# Altium project Room03.PrjPCB
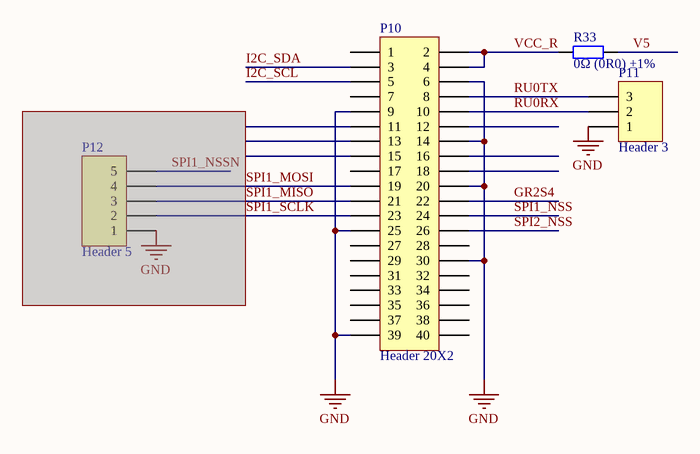
[diagram p0: raspi.SchDoc]
5 sheets, 92 parts. Net scope: global (net labels, ports and power ports of the same name join across sheets).
Board file: Room03.PcbDoc
Sheets:
  raspi.SchDoc
  power.SchDoc
  commu.SchDoc
  mcu.SchDoc
  other.SchDoc

## Sheet raspi.SchDoc
size A4

### Parts
P10  Header 20X2  [HDR2X20]
P11  Header 3  [HDR1X3]
P12  Header 5  [HDR1X5]  (masked out: inside a compile mask, not in the netlist)
R33  0Ω (0R0) ±1%  [1206_R]

### Nets
GND: P10.6 P10.9 P10.14 P10.20 P10.25 P10.30 P10.39 P11.1
V5: R33.2
GR2S4: P10.22
I2C_SCL: P10.5
I2C_SDA: P10.3
RU0RX: P10.10 P11.2
RU0TX: P10.8 P11.3
SPI1_NSS: P10.24
SPI2_NSS: P10.26
VCC_R: P10.2 P10.4 R33.1

Not connected (* = marked no-connect by the designer): P10 1 7 11 12 13 15 16 17 18 19 21 23 27 28 29 31 32 33 34 35 36 37 38 40

### Library data of the parts
P10 = Header 20X2: Header, 20-Pin, Dual row; LatestRevisionDate: 17-Jul-2002; LatestRevisionNote: Re-released for DXP Platform.; Publisher: Altium Limited
P11 = Header 3: Header, 3-Pin; LatestRevisionDate: 17-Jul-2002; LatestRevisionNote: Re-released for DXP Platform.; Publisher: Altium Limited
P12 = Header 5: Header, 5-Pin; LatestRevisionDate: 17-Jul-2002; LatestRevisionNote: Re-released for DXP Platform.; Publisher: Altium Limited
R33 = 1206 0Ω (0R0) 1%: 贴片电阻; ComponentLink1Description: 供应商链接; ComponentLink1URL: http://www.szlcsc.com/product/details_18576.html; Package: 1206; Supplier: LC; SuppliersPartNumber: C17888

## Sheet power.SchDoc
size A4
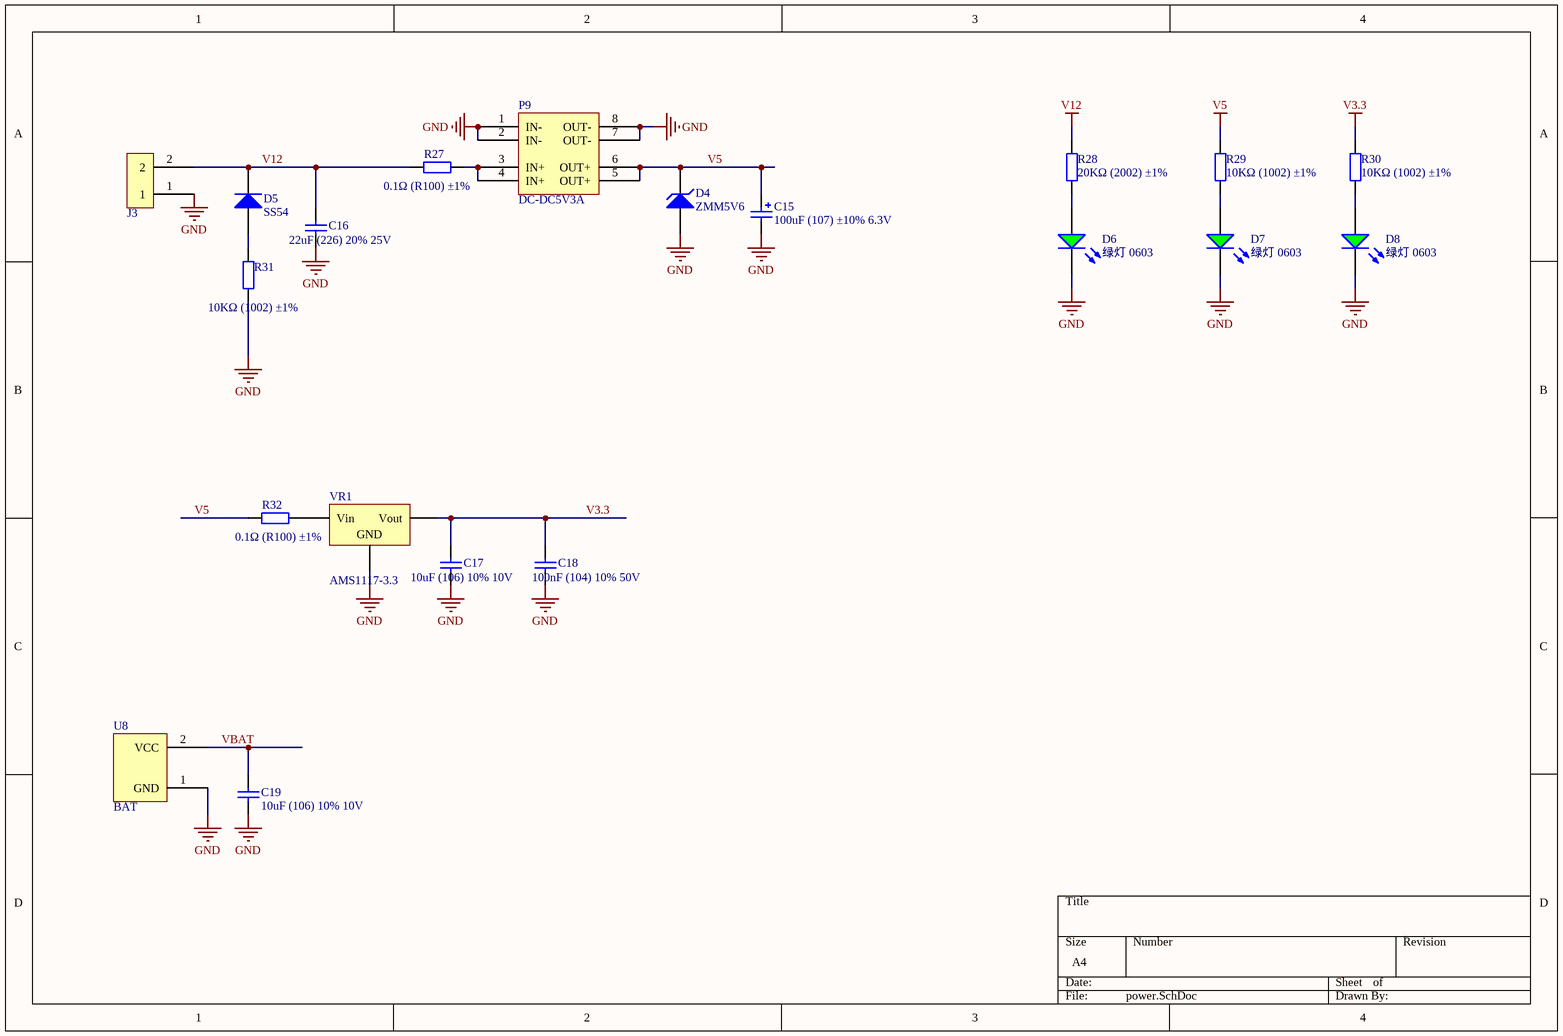
[diagram p1: power.SchDoc]

### Parts
C15  100uF (107) ±10% 6.3V  [CASE-B_3528]
C16  22uF (226) 20% 25V  [0805_C]
C17  10uF (106) 10% 10V  [0603_C]
C18  100nF (104) 10% 50V  [0603_C]
C19  10uF (106) 10% 10V  [0603_C]
D4  ZMM5V6  [LL-34]
D5  SS54  [SMA(DO-214AC)_S1]
D6  绿灯 0603  [0603_LED_S1]
D7  绿灯 0603  [0603_LED_S1]
D8  绿灯 0603  [0603_LED_S1]
J3  XK7.62-2P  [XK7.62-2P]  (value not drawn)
P9  DC-DC5V3A  [DC-DC3A]
R27  0.1Ω (R100) ±1%  [1206_R]
R28  20KΩ (2002) ±1%  [0603_R]
R29  10KΩ (1002) ±1%  [0603_R]
R30  10KΩ (1002) ±1%  [0603_R]
R31  10KΩ (1002) ±1%  [0805_R]
R32  0.1Ω (R100) ±1%  [1206_R]
U8  BAT  [BAT2032]
VR1  AMS1117-3.3  [SOT-223]

### Nets
GND: C15.2 C16.1 C17.1 C18.1 C19.1 D4.1(A) D6.K D7.K D8.K J3.1 P9.1(IN-) P9.2(IN-) P9.7(OUT-) P9.8(OUT-) R31.1 U8.1(GND) VR1.1(GND)
V3.3: C17.2 C18.2 R30.2 VR1.2(Vout)
V5: C15.1 D4.2(K) P9.5(OUT+) P9.6(OUT+) R29.2 R32.1
V12: C16.2 D5.2(K) J3.2 R27.1 R28.2
VBAT: C19.2 U8.2(VCC)
NetD5_1: D5.1(A) R31.2
NetD6_A: D6.A R28.1
NetD7_A: D7.A R29.1
NetD8_A: D8.A R30.1
NetP9_3: P9.3(IN+) P9.4(IN+) R27.2
NetR32_2: R32.2 VR1.3(Vin)

### Library data of the parts
C15 = 3528 100uF (107) 10% 6.3V: 钽电容; ComponentLink1Description: 供应商链接; ComponentLink1URL: http://www.szlcsc.com/product/details_16815.html; Package: 3528; Supplier: LC; SuppliersPartNumber: C16133
C16 = 0805 22uF (226) 20% 25V: 贴片电容; ComponentLink1Description: 供应商链接; ComponentLink1URL: http://www.szlcsc.com/product/details_46786.html; Package: 0805; Supplier: LC; SuppliersPartNumber: C45783
C17 C19 = 0603 10uF (106) 10% 10V: 贴片电容; ComponentLink1Description: 供应商链接; ComponentLink1URL: http://www.szlcsc.com/product/details_20411.html; Package: 0603; Supplier: LC; SuppliersPartNumber: C19702
C18 = 0603 100nF (104) 10% 50V: 贴片电容; ComponentLink1Description: 供应商链接; ComponentLink1URL: http://www.szlcsc.com/product/details_15331.html; Package: 0603; Supplier: LC; SuppliersPartNumber: C14663
D4 = LL-34 ZMM5V6: 稳压二极管; ComponentLink1Description: 供应商链接; ComponentLink1URL: http://www.szlcsc.com/product/details_8541.html; Package: LL-34; Supplier: LC; SuppliersPartNumber: C8062
D5 = SMA(DO-214AC) SS54: 二极管; ComponentLink1Description: 供应商链接; ComponentLink1URL: http://www.szlcsc.com/product/details_23178.html; Package: SMA(DO-214AC); Supplier: LC; SuppliersPartNumber: C22452
D6-D8 = 0603 绿灯: 发光二极管; ComponentLink1Description: 供应商链接; ComponentLink1URL: http://www.szlcsc.com/product/details_73152.html; Package: 0603; Supplier: LC; SuppliersPartNumber: C72043
P9 = DC-DC3A
R27 R32 = 1206 0.1Ω (R100) 1%: 贴片电阻; ComponentLink1Description: 供应商链接; ComponentLink1URL: http://www.szlcsc.com/product/details_26077.html; Package: 1206; Supplier: LC; SuppliersPartNumber: C25334
R28 = 0603 20KΩ (2002) 1%: 贴片电阻; ComponentLink1Description: 供应商链接; ComponentLink1URL: http://www.szlcsc.com/product/details_4591.html; Package: 0603; Supplier: LC; SuppliersPartNumber: C4184
R29 R30 = 0603 10KΩ (1002) 1%: 贴片电阻; ComponentLink1Description: 供应商链接; ComponentLink1URL: http://www.szlcsc.com/product/details_26547.html; Package: 0603; Supplier: LC; SuppliersPartNumber: C25804
R31 = 0805 10KΩ (1002) 1%: 贴片电阻; ComponentLink1Description: 供应商链接; ComponentLink1URL: http://www.szlcsc.com/product/details_18102.html; Package: 0805; Supplier: LC; SuppliersPartNumber: C17414
U8 = BAT2032
VR1 = SOT-223 AMS1117-3.3: 低压差线性稳压(LDO); ComponentLink1Description: 供应商链接; ComponentLink1URL: http://www.szlcsc.com/product/details_6652.html; Package: SOT-223; Supplier: LC; SuppliersPartNumber: C6186

## Sheet commu.SchDoc
size A4
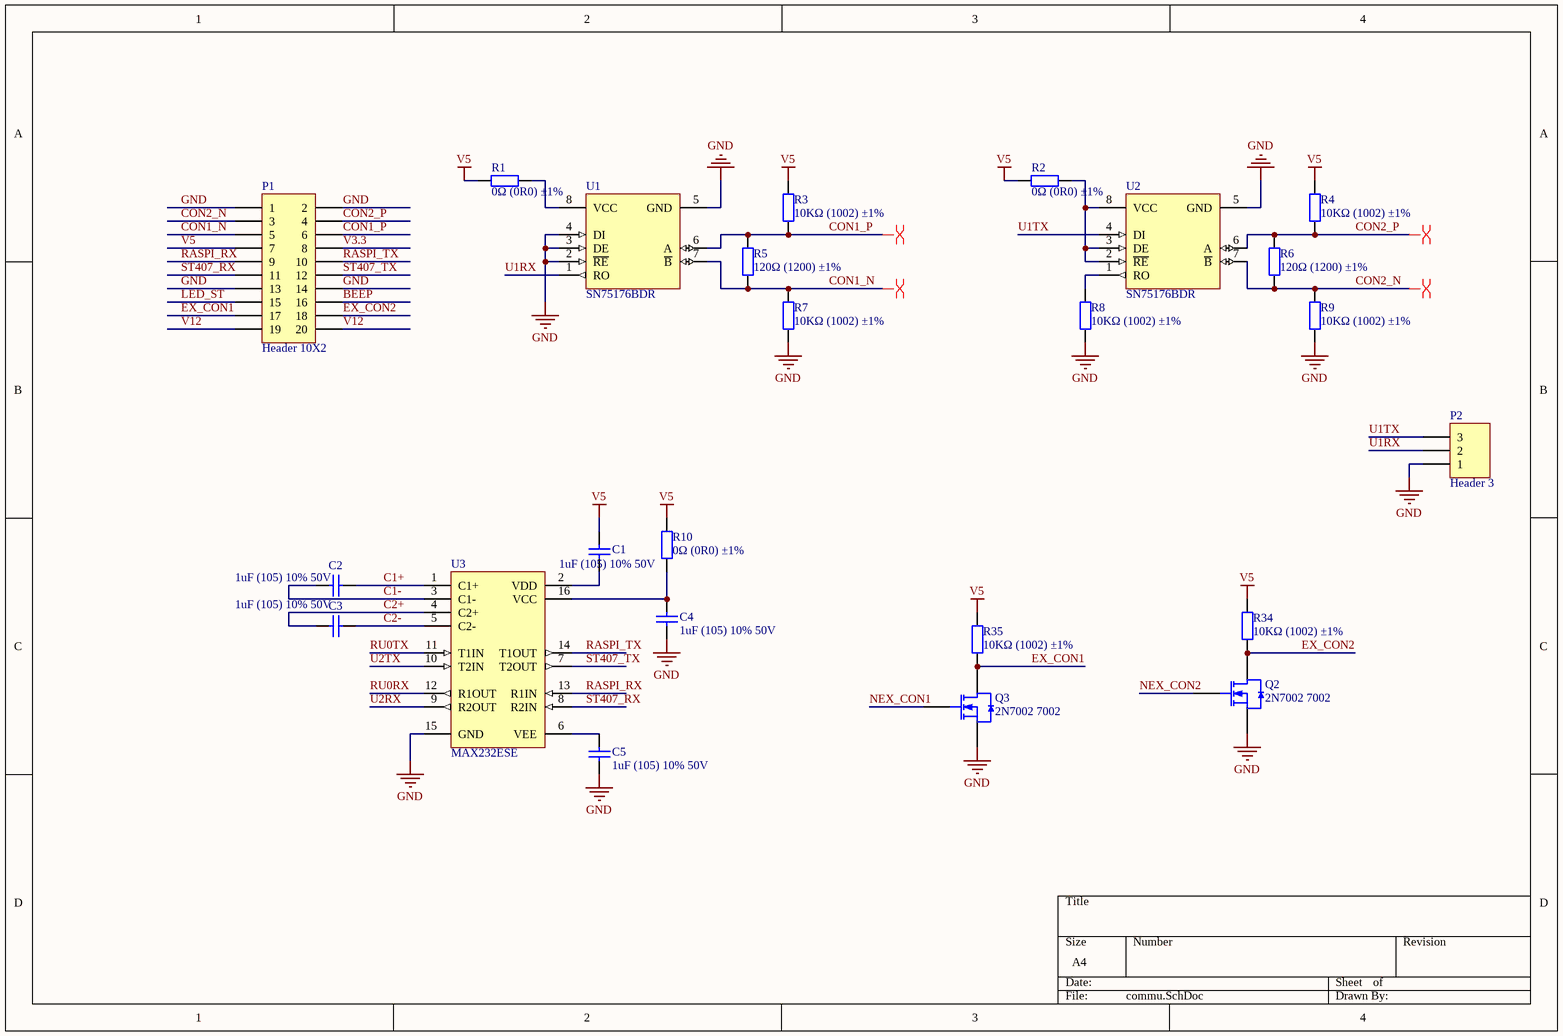
[diagram p2: commu.SchDoc]

### Parts
C1  1uF (105) 10% 50V  [0603_C]
C2  1uF (105) 10% 50V  [0603_C]
C3  1uF (105) 10% 50V  [0603_C]
C4  1uF (105) 10% 50V  [0603_C]
C5  1uF (105) 10% 50V  [0603_C]
P1  Header 10X2  [HDR2X10]
P2  Header 3  [HDR1X3]
Q2  2N7002 7002  [SOT-23(SOT-23-3)]
Q3  2N7002 7002  [SOT-23(SOT-23-3)]
R1  0Ω (0R0) ±1%  [1206_R]
R2  0Ω (0R0) ±1%  [1206_R]
R3  10KΩ (1002) ±1%  [0603_R]
R4  10KΩ (1002) ±1%  [0603_R]
R5  120Ω (1200) ±1%  [0603_R]
R6  120Ω (1200) ±1%  [0603_R]
R7  10KΩ (1002) ±1%  [0603_R]
R8  10KΩ (1002) ±1%  [0603_R]
R9  10KΩ (1002) ±1%  [0603_R]
R10  0Ω (0R0) ±1%  [1206_R]
R34  10KΩ (1002) ±1%  [0603_R]
R35  10KΩ (1002) ±1%  [0603_R]
U1  SN75176BDR  [SOIC-8_150mil]
U2  SN75176BDR  [SOIC-8_150mil]
U3  MAX232ESE  [SOIC-16_150mil]

### Nets
GND: C4.1 C5.1 P1.1 P1.2 P1.13 P1.14 P2.1 Q2.2(S) Q3.2(S) R7.1 R8.1 R9.1 U1.2(~{RE}) U1.3(DE) U1.4(DI) U1.5(GND) U2.5(GND) U3.15(GND)
V3.3: P1.8
V5: C1.2 P1.7 R1.1 R2.1 R3.2 R4.2 R10.2 R34.2 R35.2
V12: P1.19 P1.20
BEEP: P1.16
C1+: C2.2 U3.1(C1+)
C1-: C2.1 U3.3(C1-)
C2+: C3.1 U3.4(C2+)
C2-: C3.2 U3.5(C2-)
CON1_N: P1.5 R5.1 R7.2 U1.7(~{B})
CON1_P: P1.6 R3.1 R5.2 U1.6(A)
CON2_N: P1.3 R6.1 R9.2 U2.7(~{B})
CON2_P: P1.4 R4.1 R6.2 U2.6(A)
EX_CON1: P1.17 Q3.3(D) R35.1
EX_CON2: P1.18 Q2.3(D) R34.1
LED_ST: P1.15
NEX_CON1: Q3.1(G)
NEX_CON2: Q2.1(G)
RASPI_RX: P1.9 U3.13(R1IN)
RASPI_TX: P1.10 U3.14(T1OUT)
RU0RX: U3.12(R1OUT)
RU0TX: U3.11(T1IN)
ST407_RX: P1.11 U3.8(R2IN)
ST407_TX: P1.12 U3.7(T2OUT)
U1RX: P2.2 U1.1(RO)
U1TX: P2.3 U2.4(DI)
U2RX: U3.9(R2OUT)
U2TX: U3.10(T2IN)
NetC1_1: C1.1 U3.2(VDD)
NetC4_2: C4.2 R10.1 U3.16(VCC)
NetC5_2: C5.2 U3.6(VEE)
NetR1_2: R1.2 U1.8(VCC)
NetR2_2: R2.2 U2.2(~{RE}) U2.3(DE) U2.8(VCC)
NetR8_2: R8.2 U2.1(RO)

### Layout directives
differential pair: CON1_N, CON1_P, CON2_N, CON2_P

### Library data of the parts
C1-C5 = 0603 1uF (105) 10% 50V: 贴片电容; ComponentLink1Description: 供应商链接; ComponentLink1URL: http://www.szlcsc.com/product/details_16531.html; Package: 0603; Supplier: LC; SuppliersPartNumber: C15849
P1 = Header 10X2: Header, 10-Pin, Dual row; LatestRevisionDate: 17-Jul-2002; LatestRevisionNote: Re-released for DXP Platform.; Publisher: Altium Limited
P2 = Header 3: Header, 3-Pin; LatestRevisionDate: 17-Jul-2002; LatestRevisionNote: Re-released for DXP Platform.; Publisher: Altium Limited
Q2 Q3 = 2N7002 7002: MOS(场效应管); ComponentLink1Description: 供应商链接; ComponentLink1URL: http://www.szlcsc.com/product/details_9040.html; Package: SOT-23(SOT-23-3); Supplier: LC; SuppliersPartNumber: C8545
R1 R2 R10 = 1206 0Ω (0R0) 1%: 贴片电阻; ComponentLink1Description: 供应商链接; ComponentLink1URL: http://www.szlcsc.com/product/details_18576.html; Package: 1206; Supplier: LC; SuppliersPartNumber: C17888
R3 R4 R7-R9 R34 R35 = 0603 10KΩ (1002) 1%: 贴片电阻; ComponentLink1Description: 供应商链接; ComponentLink1URL: http://www.szlcsc.com/product/details_26547.html; Package: 0603; Supplier: LC; SuppliersPartNumber: C25804
R5 R6 = 0603 120Ω (1200) 1%: 贴片电阻; ComponentLink1Description: 供应商链接; ComponentLink1URL: http://www.szlcsc.com/product/details_23514.html; Package: 0603; Supplier: LC; SuppliersPartNumber: C22787
U1 U2 = SN75176BDR_[C7063]: RS-485/RS-422; ComponentLink1Description: 供应商链接; ComponentLink1URL: http://www.szlcsc.com/product/details_7535.html; Package: SOIC-8_150mil; Supplier: LC; SuppliersPartNumber: C7063
U3 = MAX232ESE_[C26860]: RS232; ComponentLink1Description: 供应商链接; ComponentLink1URL: http://www.szlcsc.com/product/details_27608.html; Package: SOIC-16_150mil; Supplier: LC; SuppliersPartNumber: C26860

## Sheet mcu.SchDoc
size A4
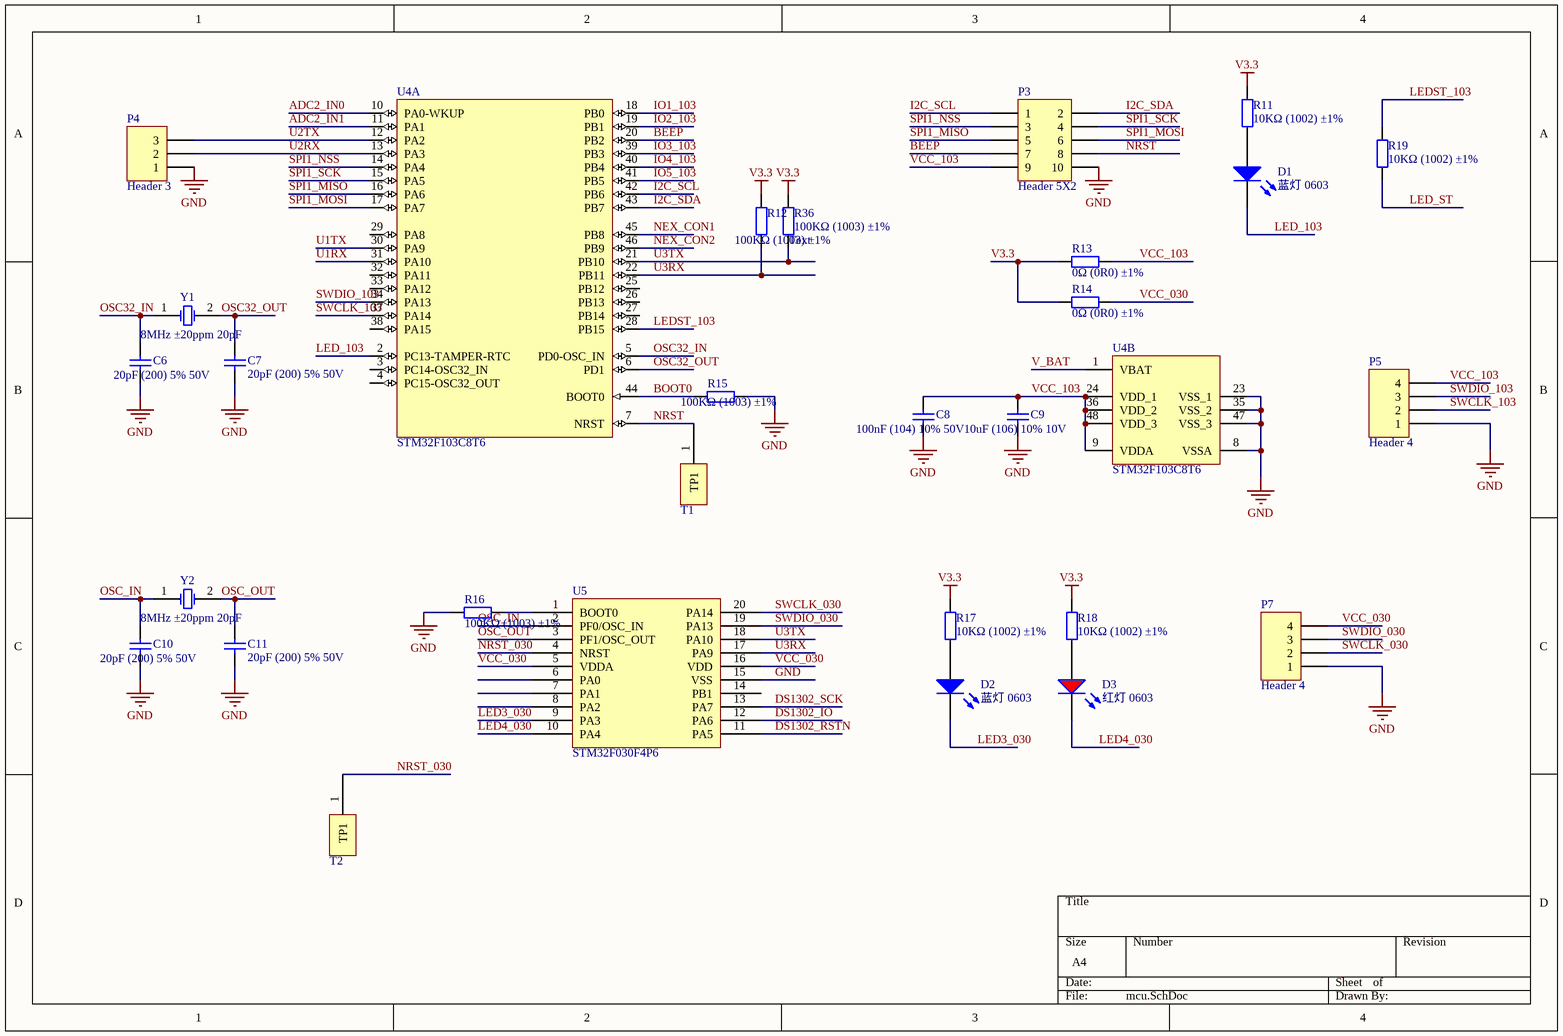
[diagram p3: mcu.SchDoc]

### Parts
C6  20pF (200) 5% 50V  [0603_C]
C7  20pF (200) 5% 50V  [0603_C]
C8  100nF (104) 10% 50V  [0603_C]
C9  10uF (106) 10% 10V  [0603_C]
C10  20pF (200) 5% 50V  [0603_C]
C11  20pF (200) 5% 50V  [0603_C]
D1  蓝灯 0603  [0603_LED_S1]
D2  蓝灯 0603  [0603_LED_S1]
D3  红灯 0603  [0603_LED_S1]
P3  Header 5X2  [HDR2X5]
P4  Header 3  [HDR1X3]
P5  Header 4  [HDR1X4]
P7  Header 4  [HDR1X4]
R11  10KΩ (1002) ±1%  [0603_R]
R12  100KΩ (1003) ±1%  [0603_R]
R13  0Ω (0R0) ±1%  [1206_R]
R14  0Ω (0R0) ±1%  [1206_R]
R15  100KΩ (1003) ±1%  [0603_R]
R16  100KΩ (1003) ±1%  [0603_R]
R17  10KΩ (1002) ±1%  [0603_R]
R18  10KΩ (1002) ±1%  [0603_R]
R19  10KΩ (1002) ±1%  [0603_R]
R36  100KΩ (1003) ±1%  [0603_R]
T1  TP1  [TP1]  (value not drawn)
T2  TP1  [TP1]  (value not drawn)
U4  STM32F103C8T6  [LQFP-48_7x7x05P]  (parts A,B of 2)
U5  STM32F030F4P6  [TSSOP-20]
Y1  8MHz ±20ppm 20pF  [SMD-5032_2P]
Y2  8MHz ±20ppm 20pF  [SMD-5032_2P]

### Nets
GND: C6.1 C7.1 C8.1 C9.2 C10.1 C11.1 P3.10 P4.1 P5.1 P7.1 R15.2 R16.1 U4.8(VSSA) U4.23(VSS_1) U4.35(VSS_2) U4.47(VSS_3) U5.15(VSS)
V3.3: R11.2 R12.2 R13.1 R14.1 R17.2 R18.2 R36.2
ADC2_IN0: U4.10(PA0-WKUP)
ADC2_IN1: U4.11(PA1)
BEEP: P3.7 U4.20(PB2)
BOOT0: R15.1 U4.44(BOOT0)
DS1302_IO: U5.12(PA6)
DS1302_RSTN: U5.11(PA5)
DS1302_SCK: U5.13(PA7)
I2C_SCL: P3.1 U4.42(PB6)
I2C_SDA: P3.2 U4.43(PB7)
IO1_103: U4.18(PB0)
IO2_103: U4.19(PB1)
IO3_103: U4.39(PB3)
IO4_103: U4.40(PB4)
IO5_103: U4.41(PB5)
LED3_030: D2.K U5.9(PA3)
LED4_030: D3.K U5.10(PA4)
LED_103: D1.K U4.2(PC13-TAMPER-RTC)
LED_ST: R19.1
LEDST_103: R19.2 U4.28(PB15)
NEX_CON1: U4.45(PB8)
NEX_CON2: U4.46(PB9)
NRST: P3.8 T1.1(TP1) U4.7(NRST)
NRST_030: T2.1(TP1) U5.4(NRST)
OSC32_IN: C6.2 U4.5(PD0-OSC_IN) Y1.1(OSC1)
OSC32_OUT: C7.2 U4.6(PD1) Y1.2(OSC2)
OSC_IN: C10.2 U5.2(PF0/OSC_IN) Y2.1(OSC1)
OSC_OUT: C11.2 U5.3(PF1/OSC_OUT) Y2.2(OSC2)
SPI1_MISO: P3.5 U4.16(PA6)
SPI1_MOSI: P3.6 U4.17(PA7)
SPI1_NSS: P3.3 U4.14(PA4)
SPI1_SCK: P3.4 U4.15(PA5)
SWCLK_030: P7.2 U5.20(PA14)
SWCLK_103: P5.2 U4.37(PA14)
SWDIO_030: P7.3 U5.19(PA13)
SWDIO_103: P5.3 U4.34(PA13)
U1RX: U4.31(PA10)
U1TX: U4.30(PA9)
U2RX: P4.2 U4.13(PA3)
U2TX: P4.3 U4.12(PA2)
U3RX: R12.1 U4.22(PB11) U5.17(PA9)
U3TX: R36.1 U4.21(PB10) U5.18(PA10)
V_BAT: U4.1(VBAT)
VCC_030: P7.4 R14.2 U5.5(VDDA) U5.16(VDD)
VCC_103: C8.2 C9.1 P3.9 P5.4 R13.2 U4.9(VDDA) U4.24(VDD_1) U4.36(VDD_2) U4.48(VDD_3)
NetD1_A: D1.A R11.1
NetD2_A: D2.A R17.1
NetD3_A: D3.A R18.1
NetR16_2: R16.2 U5.1(BOOT0)

Not connected (* = marked no-connect by the designer): U4 3(PC14-OSC32_IN) 4(PC15-OSC32_OUT) 25(PB12) 26(PB13) 27(PB14) 29(PA8) 32(PA11) 33(PA12) 38(PA15); U5 6(PA0) 7(PA1) 8(PA2) 14(PB1)

### Notes on the sheet
- (near R36) Text

### Library data of the parts
C6 C7 C10 C11 = 0603 20pF (200) 5% 50V: 贴片电容; ComponentLink1Description: 供应商链接; ComponentLink1URL: http://www.szlcsc.com/product/details_2000.html; Package: 0603; Supplier: LC; SuppliersPartNumber: C1648
C8 = 0603 100nF (104) 10% 50V: 贴片电容; ComponentLink1Description: 供应商链接; ComponentLink1URL: http://www.szlcsc.com/product/details_15331.html; Package: 0603; Supplier: LC; SuppliersPartNumber: C14663
C9 = 0603 10uF (106) 10% 10V: 贴片电容; ComponentLink1Description: 供应商链接; ComponentLink1URL: http://www.szlcsc.com/product/details_20411.html; Package: 0603; Supplier: LC; SuppliersPartNumber: C19702
D1 D2 = 0603 蓝灯: 发光二极管; ComponentLink1Description: 供应商链接; ComponentLink1URL: http://www.szlcsc.com/product/details_73150.html; Package: 0603; Supplier: LC; SuppliersPartNumber: C72041
D3 = 0603 红灯: 发光二极管; ComponentLink1Description: 供应商链接; ComponentLink1URL: http://www.szlcsc.com/product/details_2659.html; Package: 0603; Supplier: LC; SuppliersPartNumber: C2286
P3 = Header 5X2: Header, 5-Pin, Dual row; LatestRevisionDate: 17-Jul-2002; LatestRevisionNote: Re-released for DXP Platform.; Publisher: Altium Limited
P4 = Header 3: Header, 3-Pin; LatestRevisionDate: 17-Jul-2002; LatestRevisionNote: Re-released for DXP Platform.; Publisher: Altium Limited
P5 P7 = Header 4: Header, 4-Pin; LatestRevisionDate: 17-Jul-2002; LatestRevisionNote: Re-released for DXP Platform.; Publisher: Altium Limited
R11 R17-R19 = 0603 10KΩ (1002) 1%: 贴片电阻; ComponentLink1Description: 供应商链接; ComponentLink1URL: http://www.szlcsc.com/product/details_26547.html; Package: 0603; Supplier: LC; SuppliersPartNumber: C25804
R12 R15 R16 R36 = 0603 100KΩ (1003) 1%: 贴片电阻; ComponentLink1Description: 供应商链接; ComponentLink1URL: http://www.szlcsc.com/product/details_26546.html; Package: 0603; Supplier: LC; SuppliersPartNumber: C25803
R13 R14 = 1206 0Ω (0R0) 1%: 贴片电阻; ComponentLink1Description: 供应商链接; ComponentLink1URL: http://www.szlcsc.com/product/details_18576.html; Package: 1206; Supplier: LC; SuppliersPartNumber: C17888
U4 = STM32F103C8T6: ARM; ComponentLink1Description: 供应商链接; ComponentLink1URL: http://www.szlcsc.com/product/details_9243.html; Package: LQFP-48_7x7x05P; Supplier: LC; SuppliersPartNumber: C8734
U5 = STM32F030F4P6: ARM; ComponentLink1Description: 供应商链接; ComponentLink1URL: http://www.szlcsc.com/product/details_33873.html; Package: TSSOP-20; Supplier: LC; SuppliersPartNumber: C32908
Y1 Y2 = SMD-5032_2P 8MHz 20ppm 20pF: 贴片晶振; ComponentLink1Description: 供应商链接; ComponentLink1URL: http://www.szlcsc.com/product/details_117214.html; Package: SMD-5032_2P; Supplier: LC; SuppliersPartNumber: C115962

## Sheet other.SchDoc
size A4
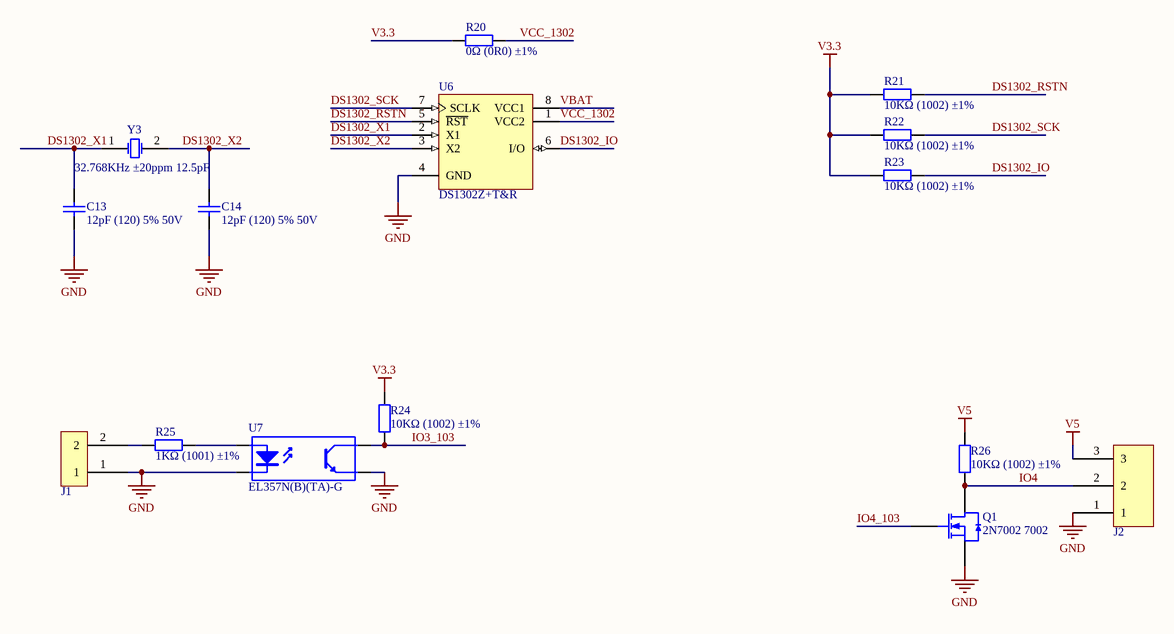
[diagram p4: other.SchDoc]

### Parts
C13  12pF (120) 5% 50V  [0603_C]
C14  12pF (120) 5% 50V  [0603_C]
J1  KF301-2P  [KF301-2P]  (value not drawn)
J2  KF301-3P  [KF301-3P]  (value not drawn)
Q1  2N7002 7002  [SOT-23(SOT-23-3)]
R20  0Ω (0R0) ±1%  [1206_R]
R21  10KΩ (1002) ±1%  [0603_R]
R22  10KΩ (1002) ±1%  [0603_R]
R23  10KΩ (1002) ±1%  [0603_R]
R24  10KΩ (1002) ±1%  [1206_R]
R25  1KΩ (1001) ±1%  [1206_R]
R26  10KΩ (1002) ±1%  [1206_R]
U6  DS1302Z+T&R  [SOIC-8_150mil]
U7  EL357N(B)(TA)-G  [SOP-4_P2.54]
Y3  32.768KHz ±20ppm 12.5pF  [SMD-3215_2P FC - 135]

### Nets
GND: C13.1 C14.1 J1.1 J2.1 Q1.2(S) U6.4(GND) U7.2(K) U7.3(E)
V3.3: R20.1 R21.1 R22.1 R23.1 R24.2
V5: J2.3 R26.2
DS1302_IO: R23.2 U6.6(I/O)
DS1302_RSTN: R21.2 U6.5(~{RST})
DS1302_SCK: R22.2 U6.7(SCLK)
DS1302_X1: C13.2 U6.2(X1) Y3.1(OSC1)
DS1302_X2: C14.2 U6.3(X2) Y3.2(OSC2)
IO3_103: R24.1 U7.4(C)
IO4: J2.2 Q1.3(D) R26.1
IO4_103: Q1.1(G)
VBAT: U6.8(VCC1)
VCC_1302: R20.2 U6.1(VCC2)
NetJ1_2: J1.2 R25.1
NetR25_2: R25.2 U7.1(A)

### Library data of the parts
C13 C14 = 0603 12pF (120) 5% 50V: 贴片电容; ComponentLink1Description: 供应商链接; ComponentLink1URL: http://www.szlcsc.com/product/details_39506.html; Package: 0603; Supplier: LC; SuppliersPartNumber: C38523
Q1 = 2N7002 7002: MOS(场效应管); ComponentLink1Description: 供应商链接; ComponentLink1URL: http://www.szlcsc.com/product/details_9040.html; Package: SOT-23(SOT-23-3); Supplier: LC; SuppliersPartNumber: C8545
R20 = 1206 0Ω (0R0) 1%: 贴片电阻; ComponentLink1Description: 供应商链接; ComponentLink1URL: http://www.szlcsc.com/product/details_18576.html; Package: 1206; Supplier: LC; SuppliersPartNumber: C17888
R21-R23 = 0603 10KΩ (1002) 1%: 贴片电阻; ComponentLink1Description: 供应商链接; ComponentLink1URL: http://www.szlcsc.com/product/details_26547.html; Package: 0603; Supplier: LC; SuppliersPartNumber: C25804
R24 R26 = 1206 10KΩ (1002) 1%: 贴片电阻; ComponentLink1Description: 供应商链接; ComponentLink1URL: http://www.szlcsc.com/product/details_18590.html; Package: 1206; Supplier: LC; SuppliersPartNumber: C17902
R25 = 1206 1KΩ (1001) 1%: 贴片电阻; ComponentLink1Description: 供应商链接; ComponentLink1URL: http://www.szlcsc.com/product/details_4817.html; Package: 1206; Supplier: LC; SuppliersPartNumber: C4410
U6 = DS1302Z+T&R_[C8959]: 实时时钟; ComponentLink1Description: 供应商链接; ComponentLink1URL: http://www.szlcsc.com/product/details_9478.html; Package: SOIC-8_150mil; Supplier: LC; SuppliersPartNumber: C8959
U7 = EL357N(B)(TA)-G_[C6649]: 贴片光耦; ComponentLink1Description: 供应商链接; ComponentLink1URL: http://www.szlcsc.com/product/details_7114.html; Package: SOP-4_P2.54; Supplier: LC; SuppliersPartNumber: C6649
Y3 = SMD-3215_2P 32.768KHz 20ppm 12.5pF: 贴片晶振; ComponentLink1Description: 供应商链接; ComponentLink1URL: http://www.szlcsc.com/product/details_33310.html; Package: SMD-3215_2P; Supplier: LC; SuppliersPartNumber: C32346

## Nets that join several sheets
GND: raspi (8 pins), power (17 pins), commu (18 pins), mcu (17 pins), other (8 pins)
V3.3: power (C17.2 C18.2 R30.2 VR1.2), commu (P1.8), mcu (7 pins), other (5 pins)
V5: raspi (R33.2), power (6 pins), commu (9 pins), other (J2.3 R26.2)
V12: power (5 pins), commu (P1.19 P1.20)
BEEP: commu (P1.16), mcu (P3.7 U4.20)
DS1302_IO: mcu (U5.12), other (R23.2 U6.6)
DS1302_RSTN: mcu (U5.11), other (R21.2 U6.5)
DS1302_SCK: mcu (U5.13), other (R22.2 U6.7)
I2C_SCL: raspi (P10.5), mcu (P3.1 U4.42)
I2C_SDA: raspi (P10.3), mcu (P3.2 U4.43)
IO3_103: mcu (U4.39), other (R24.1 U7.4)
IO4_103: mcu (U4.40), other (Q1.1)
LED_ST: commu (P1.15), mcu (R19.1)
NEX_CON1: commu (Q3.1), mcu (U4.45)
NEX_CON2: commu (Q2.1), mcu (U4.46)
RU0RX: raspi (P10.10 P11.2), commu (U3.12)
RU0TX: raspi (P10.8 P11.3), commu (U3.11)
SPI1_NSS: raspi (P10.24), mcu (P3.3 U4.14)
U1RX: commu (P2.2 U1.1), mcu (U4.31)
U1TX: commu (P2.3 U2.4), mcu (U4.30)
U2RX: commu (U3.9), mcu (P4.2 U4.13)
U2TX: commu (U3.10), mcu (P4.3 U4.12)
VBAT: power (C19.2 U8.2), other (U6.8)